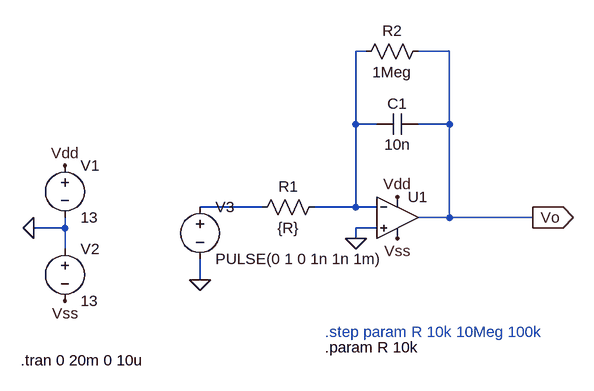
[diagram p0: schematic Modified Ideal opamp inverting integrator.asc]
Modified Ideal opamp inverting integrator.asc, the LTspice schematic file:
Version 4
SHEET 1 880 680
WIRE 240 -160 224 -160
WIRE 368 -160 320 -160
WIRE 224 -48 224 -160
WIRE 256 -48 224 -48
WIRE 368 -48 368 -160
WIRE 368 -48 320 -48
WIRE 80 80 -16 80
WIRE 224 80 224 -48
WIRE 224 80 160 80
WIRE 256 80 224 80
WIRE 368 96 368 -48
WIRE 368 96 320 96
WIRE 496 96 368 96
WIRE -224 112 -224 96
WIRE -224 112 -272 112
WIRE 256 112 224 112
WIRE 224 128 224 112
WIRE -224 144 -224 112
WIRE -16 192 -16 160
FLAG -272 112 0
FLAG -224 16 Vdd
FLAG 288 64 Vdd
FLAG -224 224 Vss
FLAG 288 128 Vss
FLAG 224 128 0
FLAG -16 192 0
FLAG 496 96 Vo
IOPIN 496 96 Out
SYMBOL voltage -224 0 R0
WINDOW 123 0 0 Left 0
WINDOW 39 0 0 Left 0
SYMATTR InstName V1
SYMATTR Value 13
SYMBOL voltage -224 128 R0
WINDOW 123 0 0 Left 0
WINDOW 39 0 0 Left 0
SYMATTR InstName V2
SYMATTR Value 13
SYMBOL Opamps\\UniversalOpamp2 288 96 R0
SYMATTR InstName U1
SYMBOL res 176 64 R90
WINDOW 0 0 56 VBottom 2
WINDOW 3 32 56 VTop 2
SYMATTR InstName R1
SYMATTR Value {R}
SYMBOL cap 320 -64 R90
WINDOW 0 0 32 VBottom 2
WINDOW 3 32 32 VTop 2
SYMATTR InstName C1
SYMATTR Value 10n
SYMBOL voltage -16 64 R0
WINDOW 123 0 0 Left 0
WINDOW 39 0 0 Left 0
SYMATTR InstName V3
SYMATTR Value PULSE(0 1 0 1n 1n 1m)
SYMBOL res 336 -176 R90
WINDOW 0 0 56 VBottom 2
WINDOW 3 32 56 VTop 2
SYMATTR InstName R2
SYMATTR Value 1Meg
TEXT 176 272 Left 2 ;.step param R 10k 10Meg 100k
TEXT 176 296 Left 2 !.param R 10k
TEXT -292 316 Left 2 !.tran 0 20m 0 10u

The netlist it stands for:
* Modified Ideal opamp inverting integrator.asc
V1 Vdd 0 13
V2 0 Vss 13
XU1 0 N001 Vdd Vss Vo level.2 Avol=1Meg GBW=10Meg Slew=10Meg ilimit=25m rail=0 Vos=0 phimargin=45 en=0 enk=0 in=0 ink=0 Rin=500Meg  ; pins IN+ IN- V+ V- OUT
R1 N001 N002 {R}
C1 Vo N001 10n
V3 N002 0 PULSE(0 1 0 1n 1n 1m)
R2 Vo N001 1Meg
* .step param R 10k 10Meg 100k
.param R 10k
.tran 0 20m 0 10u
.lib UniversalOpamps2.sub
.backanno
.end